# Altium schematic sheet SkalaMiljanLjubicaPrijemnik.SchDoc
size A
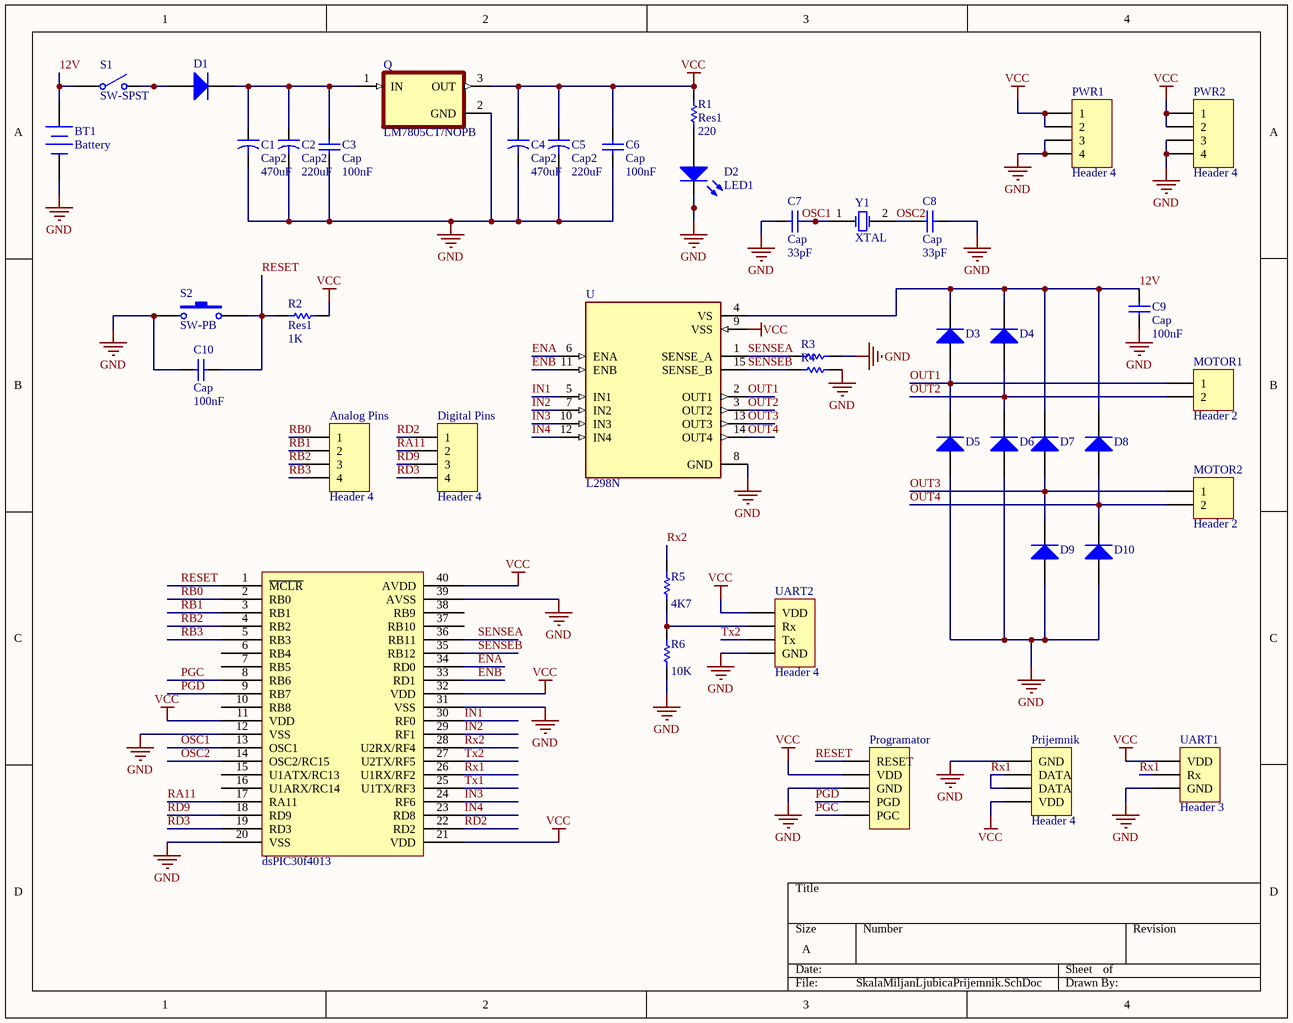
[diagram p0: SkalaMiljanLjubicaPrijemnik.SchDoc]

## Parts
?  dsPIC30f4013
Analog_Pins  Header 4  [HDR1X4]
BT1  Battery  [BAT-2]
C1  Cap2  value 470uF  [CAPR5-4X5]
C2  Cap2  value 220uF  [CAPR5-4X5]
C3  Cap  value 100nF  [RAD-0.3]
C4  Cap2  value 470uF  [CAPR5-4X5]
C5  Cap2  value 220uF  [CAPR5-4X5]
C6  Cap  value 100nF  [RAD-0.3]
C7  Cap  value 33pF  [RAD-0.3]
C8  Cap  value 33pF  [RAD-0.3]
C9  Cap  value 100nF  [RAD-0.3]
C10  Cap  value 100nF  [RAD-0.3]
D1  Diode 1N4007  [DO-41]  (value not drawn)
D2  LED1  [LED-1]
D3  Diode 1N4007  [DO-41]  (value not drawn)
D4  Diode 1N4007  [DO-41]  (value not drawn)
D5  Diode 1N4007  [DO-41]  (value not drawn)
D6  Diode 1N4007  [DO-41]  (value not drawn)
D7  Diode 1N4007  [DO-41]  (value not drawn)
D8  Diode 1N4007  [DO-41]  (value not drawn)
D9  Diode 1N4007  [DO-41]  (value not drawn)
D10  Diode 1N4007  [DO-41]  (value not drawn)
Digital_Pins  Header 4  [HDR1X4]
MOTOR1  Header 2  [HDR1X2]
MOTOR2  Header 2  [HDR1X2]
Prijemnik  Header 4  [HDR1X4]
Programator  Header 5  [HDR1X5]  (value not drawn)
PWR1  Header 4  [HDR1X4]
PWR2  Header 4  [HDR1X4]
Q  LM7805CT/NOPB  [TO254P1054X470X2600-3]
R1  Res1  value 220  [AXIAL-0.3]
R2  Res1  value 1K  [AXIAL-0.3]
R3  Res1  [AXIAL-0.3]  (value not drawn)
R4  Res1  [AXIAL-0.3]  (value not drawn)
R5  value 4K7  [AXIAL-0.3]  (hidden comment: Res1)
R6  value 10K  [AXIAL-0.3]  (hidden comment: Res1)
S1  SW-SPST  [SPST-2]
S2  SW-PB  [SPST-2]
U  L298N  [TO127P2020X500X2100-15]
UART1  Header 3  [HDR1X3]
UART2  Header 4  [HDR1X4]
Y1  XTAL  [R38]

## Nets
GND: ?.12(VSS) ?.20(VSS) ?.31(VSS) ?.39(AVSS) BT1.2(-) C1.2 C2.2 C3.1 C4.2 C5.2 C6.1 C7.1 C8.2 C9.1 C10.1 D2.2(K) D5.1(A) D6.1(A) D9.1(A) D10.1(A) Prijemnik.1(GND) Programator.3(GND) PWR1.3 PWR1.4 PWR2.3 PWR2.4 Q.2(GND) R3.2 R4.2 R6.1 S2.1 U.8(GND) UART1.3(GND) UART2.4(GND)
VCC: ?.11(VDD) ?.21(VDD) ?.32(VDD) ?.40(AVDD) C4.1 C5.1 C6.2 Prijemnik.4(VDD) Programator.2(VDD) PWR1.1 PWR1.2 PWR2.1 PWR2.2 Q.3(OUT) R1.2 R2.2 U.9(VSS) UART1.1(VDD) UART2.1(VDD)
12V: BT1.1(+) C9.2 D3.2(K) D4.2(K) D7.2(K) D8.2(K) S1.1(COMMON) U.4(VS)
ENA: ?.34(RD0) U.6(ENA)
ENB: ?.33(RD1) U.11(ENB)
IN1: ?.30(RF0) U.5(IN1)
IN2: ?.29(RF1) U.7(IN2)
IN3: ?.24(RF6) U.10(IN3)
IN4: ?.23(RD8) U.12(IN4)
OSC1: ?.13(OSC1) C7.2 Y1.1(OSC1)
OSC2: ?.14(OSC2/RC15) C8.1 Y1.2(OSC2)
OUT1: D3.1(A) D5.2(K) MOTOR1.1 U.2(OUT1)
OUT2: D4.1(A) D6.2(K) MOTOR1.2 U.3(OUT2)
OUT3: D7.1(A) D9.2(K) MOTOR2.1 U.13(OUT3)
OUT4: D8.1(A) D10.2(K) MOTOR2.2 U.14(OUT4)
PGC: ?.8(RB6) Programator.5(PGC)
PGD: ?.9(RB7) Programator.4(PGD)
RA11: ?.17(RA11) Digital_Pins.2
RB0: ?.2(RB0) Analog_Pins.1
RB1: ?.3(RB1) Analog_Pins.2
RB2: ?.4(RB2) Analog_Pins.3
RB3: ?.5(RB3) Analog_Pins.4
RD2: ?.22(RD2) Digital_Pins.1
RD3: ?.19(RD3) Digital_Pins.4
RD9: ?.18(RD9) Digital_Pins.3
RESET: ?.1(~{MCLR}) C10.2 Programator.1(RESET) R2.1 S2.2
Rx1: ?.26(U1RX/RF2) Prijemnik.2(DATA) Prijemnik.3(DATA) UART1.2(Rx)
Rx2: ?.28(U2RX/RF4) R5.2
SENSEA: ?.36(RB11) R3.1 U.1(SENSE_A)
SENSEB: ?.35(RB12) R4.1 U.15(SENSE_B)
Tx1: ?.25(U1TX/RF3)
Tx2: ?.27(U2TX/RF5) UART2.3(Tx)
NetC1_1: C1.1 C2.1 C3.2 D1.2(K) Q.1(IN)
NetD1_1: D1.1(A) S1.2(NO)
NetD2_1: D2.1(A) R1.1
NetR5_1: R5.1 R6.2 UART2.2(Rx)

Not connected (* = marked no-connect by the designer): ? 6(RB4) 7(RB5) 10(RB8) 15(U1ATX/RC13) 16(U1ARX/RC14) 37(RB10) 38(RB9)

## Library data of the parts
Analog_Pins Digital_Pins Prijemnik PWR1 PWR2 UART2 = Header 4: Header, 4-Pin; LatestRevisionDate: 17-Jul-2002; LatestRevisionNote: Re-released for DXP Platform.; Publisher: Altium Limited
BT1 = Battery: Multicell Battery; Published: 24-Mar-1999; LatestRevisionDate: 17-Jul-2002; LatestRevisionNote: Re-released for DXP Platform.; PackageReference: BAT-2; Publisher: Altium Limited; PackageDescription: Battery; 2 Leads
C1 C2 C4 C5 = Cap2: Capacitor; Published: 23-Sep-2002; PackageReference: CAPR5-4X5; Publisher: Altium Limited; PackageDescription: Capacitor; 2 Leads
C3 C6-C10 = Cap: Capacitor; Published: 8-Jun-2000; LatestRevisionDate: 17-Jul-2002; LatestRevisionNote: Re-released for DXP Platform.; PackageReference: RAD-0.3; Publisher: Altium Limited; PackageDescription: Radial Cap, Thru-Hole; 2 Leads; 0.3 in Pin Spacing
D1 D3-D10 = Diode 1N4007: 1 Amp General Purpose Rectifier; Published: 8-Jun-2000; LatestRevisionDate: 17-Jul-2002; LatestRevisionNote: Re-released for DXP Platform.; DatasheetVersion: 1998; PackageVersion: Aug-1999; PackageReference: DO-41; Publisher: Altium Limited; PackageDescription: Diode, Axial; Body 5.2 x 2.7 mm (LxDia. max), Lead Dia. 0.86 mm (max); Code_JEDEC: DO-204-AL; ComponentLink1Description: Manufacturer Link; ComponentLink1URL: http://www.fairchildsemi.com/; ComponentLink2Description: Datasheet; ComponentLink2URL: http://www.fairchildsemi.com/ds/1N%2F1N4001.pdf
D2 = LED1: Typical RED GaAs LED; Published: 8-Jun-2000; LatestRevisionDate: 08-Jul-2005; LatestRevisionNote: Mech Layer 1 removed.; PackageReference: LED-1; Publisher: Altium Limited; PackageDescription: LED; 2 Leads
MOTOR1 MOTOR2 = Header 2: Header, 2-Pin; LatestRevisionDate: 17-Jul-2002; LatestRevisionNote: Re-released for DXP Platform.; Publisher: Altium Limited
Programator = Header 5: Header, 5-Pin; LatestRevisionDate: 17-Jul-2002; LatestRevisionNote: Re-released for DXP Platform.; Publisher: Altium Limited
Q = LM7805CT/NOPB: Linear Voltage Regulator IC 1 Output 1A TO-220-3; MF: ON Semiconductor; MP: LM7805CT; SnapEDA_Link: https://www.snapeda.com/parts/LM7805CT/ON%20Semiconductor/view-part/546231/?ref=snap; Price: None; Package: TO-220 ON Semiconductor; Value: *; Availability: Unavailable
R1-R6 = Res1: Resistor; Published: 8-Jun-2000; LatestRevisionDate: 17-Jul-2002; LatestRevisionNote: Re-released for DXP Platform.; PackageReference: AXIAL-0.3; Publisher: Altium Limited; PackageDescription: Axial Device, Thru-Hole; 2 Leads; 0.3 in Pin Spacing
S1 = SW-SPST: Single-Pole, Single-Throw Switch; Published: 24-Mar-1999; LatestRevisionDate: 17-Jul-2002; LatestRevisionNote: Re-released for DXP Platform.; PackageReference: SPST-2; Publisher: Altium Limited; PackageDescription: Switch; 2 Leads
S2 = SW-PB: Switch; Published: 24-Mar-1999; LatestRevisionDate: 17-Jul-2002; LatestRevisionNote: Re-released for DXP Platform.; PackageReference: SPST-2; Publisher: Altium Limited; PackageDescription: Switch; 2 Leads
U = L298N: Half Bridge _4_ Driver DC Motors, Relays, Solenoids, Stepper Motors Bipolar 15-Multiwatt; MF: STMicroelectronics; MP: L298N; Package: Multiwatt-15 STMicroelectronics; Price: None; Availability: Unavailable; Value: *; SnapEDA_Link: https://www.snapeda.com/parts/L298N/STMicroelectronics/view-part/294022/?ref=snap
UART1 = Header 3: Header, 3-Pin; LatestRevisionDate: 17-Jul-2002; LatestRevisionNote: Re-released for DXP Platform.; Publisher: Altium Limited
Y1 = XTAL: Crystal Oscillator; Published: 8-Jun-2000; LatestRevisionDate: 17-Jul-2002; LatestRevisionNote: Re-released for DXP Platform.; PackageReference: R38; Publisher: Altium Limited; PackageDescription: Crystal, Thru-Hole; 2 Leads; Body 3.1 x 8.2 mm (Dia.xH)